# EAGLE schematic avr (EAGLE 5.07)
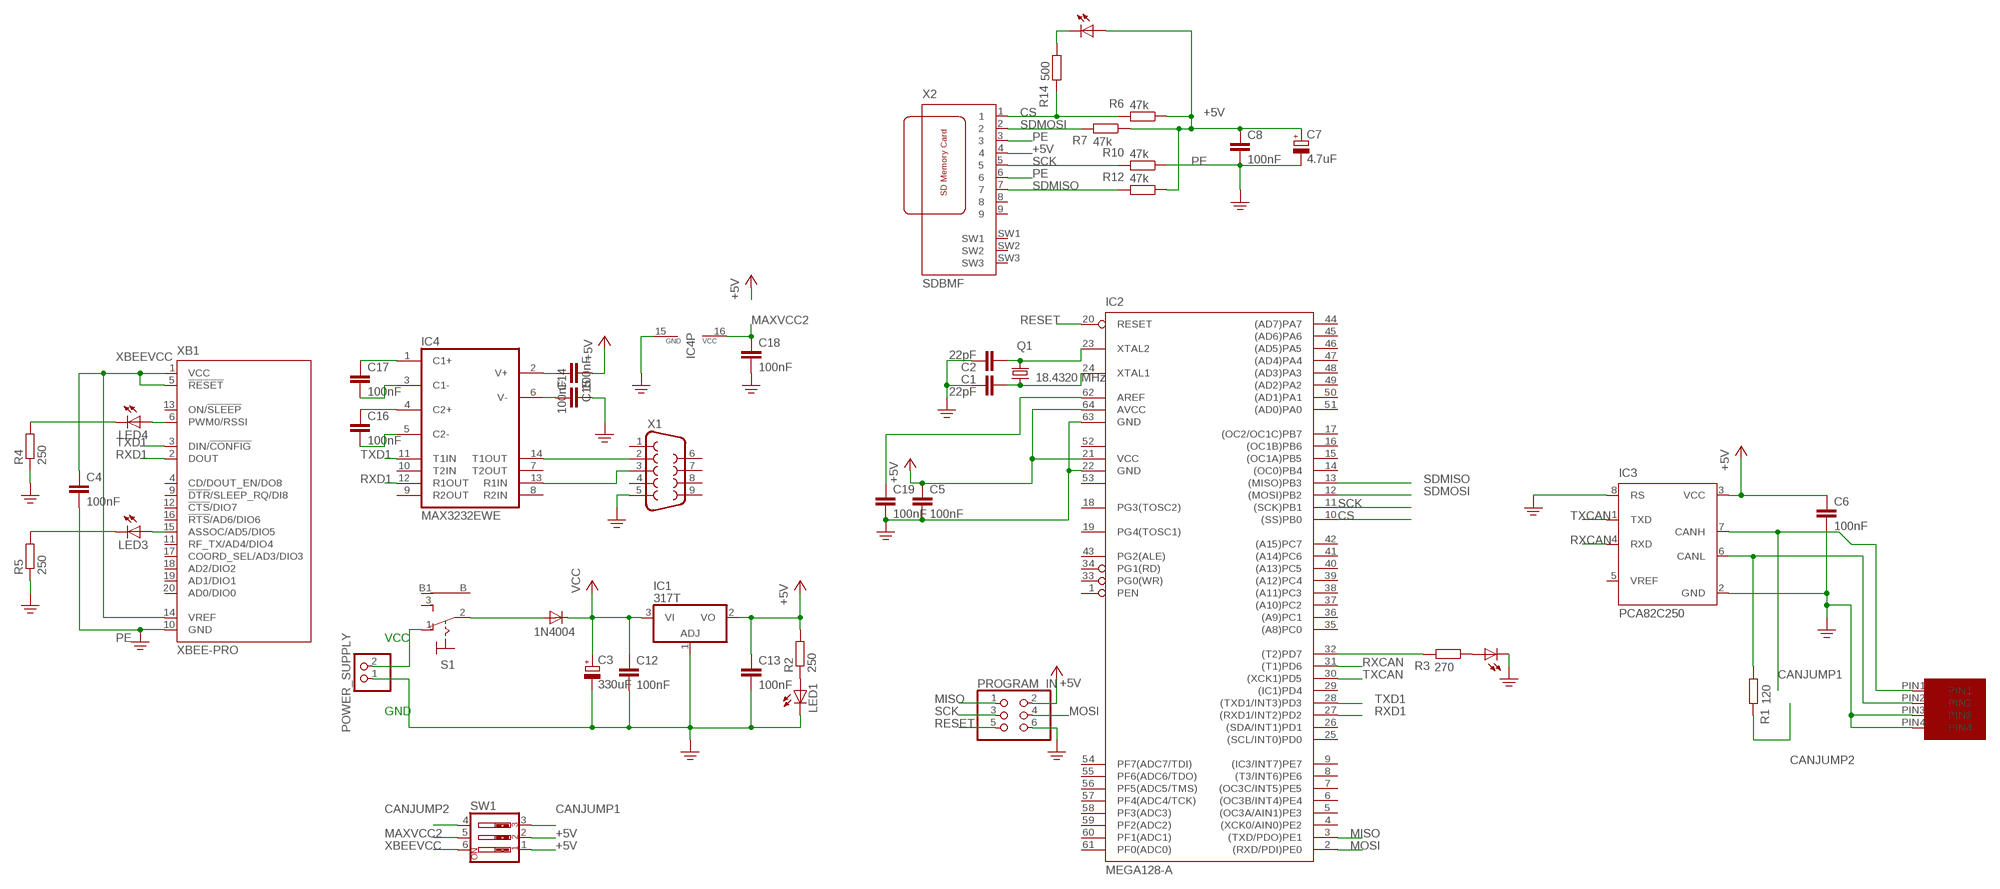
[diagram p0: schematic, sheet 1]

## Parts
C1  22pF  C5/2.5  [C5B2.5]
C2  22pF  C5/2.5  [C5B2.5]
C3  330uF  CPOL-EUE15-5AXIAL  [E15-5]
C4  100nF  C-EU050-024X044  [C050-024X044]
C5  100nF  C-EU050-024X044  [C050-024X044]
C6  100nF  C-EU050-024X044  [C050-024X044]
C7  4.7uF  CPOL-EUE15-5AXIAL  [E15-5]
C8  100nF  C-EU050-024X044  [C050-024X044]
C12  100nF  C-EU050-024X044  [C050-024X044]
C13  100nF  C-EU050-024X044  [C050-024X044]
C14  100nF  C-EU050-024X044  [C050-024X044]
C15  100nF  C-EU050-024X044  [C050-024X044]
C16  100nF  C-EU050-024X044  [C050-024X044]
C17  100nF  C-EU050-024X044  [C050-024X044]
C18  100nF  C-EU050-024X044  [C050-024X044]
C19  100nF  C-EU050-024X044  [C050-024X044]
D1  1N4004  [DO41-10]
IC1  317T  [TO220H]
IC2  MEGA128-A  [TQFP64]
IC3  PCA82C250  [DIL08]
IC4  MAX3232EWE  [SO16L]
LED1  LED5MM  [LED5MM]
LED2  LED5MM  [LED5MM]
LED3  LED5MM  [LED5MM]
LED4  LED5MM  [LED5MM]
LED5  LED5MM  [LED5MM]
POWER_SUPPLY  PINHD-1X2  [1X02]
PROGRAM_IN  PINHD-2X3  [2X03]
Q1  18.4320 MHz  CRYSTALHC49U70  [HC49U70]
R1  120  R-EU_0207/10  [0207/10]
R2  250  R-EU_0207/10  [0207/10]
R3  270  R-EU_0207/10  [0207/10]
R4  250  R-EU_0207/10  [0207/10]
R5  250  R-EU_0207/10  [0207/10]
R6  47k  R-EU_0207/10  [0207/10]
R7  47k  R-EU_0207/10  [0207/10]
R10  47k  R-EU_0207/10  [0207/10]
R12  47k  R-EU_0207/10  [0207/10]
R14  500  R-EU_0207/10  [0207/10]
S1  LPV-1  [LPV-1]
SW1  SW_DIP-3  [EDG-03]
U$1  MICROFIT4  [MICROFIT4SOCK]
X1  F09HP  [F09HP]
X2  SDBMF  [SDBMF-009XXBXX2]
XB1  XBEE-PRO  [XBEE-PRO]

## Nets
+5V: C5.1 C6.1 C7.+ C8.1 C13.1 C15.1 IC1.2(VO) IC2.21(VCC) IC2.64(AVCC) IC3.3(VCC) LED5.A PROGRAM_IN.2 R2.2 R6.1 R7.1 R12.1 SW1.1 SW1.2 X2.4
CANJUMP1: IC3.7(CANH) SW1.3 U$1.PIN1
CANJUMP2: R1.2 SW1.4
CS: IC2.10((SS)PB0) R6.2 R14.2 X2.1
MAXVCC2: C18.1 IC4.16(VCC) SW1.5
MISO: IC2.3((TXD/PDO)PE1) PROGRAM_IN.1
MOSI: IC2.2((RXD/PDI)PE0) PROGRAM_IN.4
N$1: C1.2 IC2.24(XTAL1) Q1.1
N$2: C2.2 IC2.23(XTAL2) Q1.2
N$4: D1.A S1.2(P)
N$5: POWER_SUPPLY.2 S1.1(O)
N$6: LED1.A R2.1
N$8: LED2.A R3.1
N$10: C19.1 IC2.62(AREF)
N$21: IC4.13(R1IN) X1.3
N$33: IC4.14(T1OUT) X1.2
N$35: C17.1 IC4.1(C1+)
N$36: C17.2 IC4.3(C1-)
N$37: C16.1 IC4.4(C2+)
N$38: C16.2 IC4.5(C2-)
N$39: C14.1 IC4.6(V-)
N$41: C15.2 IC4.2(V+)
N$43: IC2.32((T2)PD7) R3.2
N$50: LED4.A XB1.6(PWM0/RSSI)
N$51: IC3.6(CANL) R1.1 U$1.PIN2
N$52: LED3.A XB1.15(ASSOC/AD5/DIO5)
N$57: LED4.K(C) R4.2
N$58: LED3.K(C) R5.2
N$59: LED5.K(C) R14.1
PE: C1.1 C2.1 C3.- C4.2 C5.2 C6.2 C7.- C8.2 C12.2 C13.2 C14.2 C18.2 C19.2 IC1.1(ADJ) IC2.22(GND) IC2.63(GND) IC3.2(GND) IC3.8(RS) IC4.15(GND) LED1.K(C) LED2.K(C) POWER_SUPPLY.1 PROGRAM_IN.6 R4.1 R5.1 R10.1 U$1.PIN3 U$1.PIN4 X1.5 X2.3 X2.6 XB1.10(GND)
RESET: IC2.20(RESET) PROGRAM_IN.5
RXCAN: IC2.31((T1)PD6) IC3.4(RXD)
RXD1: IC2.27((RXD1/INT2)PD2) IC4.12(R1OUT) XB1.2(DOUT)
SCK: IC2.11((SCK)PB1) PROGRAM_IN.3 R10.2 X2.5
SDMISO: IC2.13((MISO)PB3) R12.2 X2.7
SDMOSI: IC2.12((MOSI)PB2) R7.2 X2.2
TXCAN: IC2.30((XCK1)PD5) IC3.1(TXD)
TXD1: IC2.28((TXD1/INT3)PD3) IC4.11(T1IN) XB1.3(DIN/!CONFIG)
VCC: C3.+ C12.1 D1.C IC1.3(VI)
XBEEVCC: C4.1 SW1.6 XB1.1(VCC) XB1.5(!RESET) XB1.14(VREF)
Unconnected: IC2.1(PEN) IC2.4((XCK0/AIN0)PE2) IC2.5((OC3A/AIN1)PE3) IC2.6((OC3B/INT4)PE4) IC2.7((OC3C/INT5)PE5) IC2.8((T3/INT6)PE6) IC2.9((IC3/INT7)PE7) IC2.14((OC0)PB4) IC2.15((OC1A)PB5) IC2.16((OC1B)PB6) IC2.17((OC2/OC1C)PB7) IC2.18(PG3(TOSC2)) IC2.19(PG4(TOSC1)) IC2.25((SCL/INT0)PD0) IC2.26((SDA/INT1)PD1) IC2.29((IC1)PD4) IC2.33(PG0(WR)) IC2.34(PG1(RD)) IC2.35((A8)PC0) IC2.36((A9)PC1) IC2.37((A10)PC2) IC2.38((A11)PC3) IC2.39((A12)PC4) IC2.40((A13)PC5) IC2.41((A14)PC6) IC2.42((A15)PC7) IC2.43(PG2(ALE)) IC2.44((AD7)PA7) IC2.45((AD6)PA6) IC2.46((AD5)PA5) IC2.47((AD4)PA4) IC2.48((AD3)PA3) IC2.49((AD2)PA2) IC2.50((AD1)PA1) IC2.51((AD0)PA0) IC2.54(PF7(ADC7/TDI)) IC2.55(PF6(ADC6/TDO)) IC2.56(PF5(ADC5/TMS)) IC2.57(PF4(ADC4/TCK)) IC2.58(PF3(ADC3)) IC2.59(PF2(ADC2)) IC2.60(PF1(ADC1)) IC2.61(PF0(ADC0)) IC3.5(VREF) IC4.7(T2OUT) IC4.8(R2IN) IC4.9(R2OUT) IC4.10(T2IN) S1.3(S) S1.B S1.B1 X1.1 X1.4 X1.6 X1.7 X1.8 X1.9 X2.8 X2.9 X2.SW1 X2.SW2 X2.SW3 XB1.4(CD/DOUT_EN/DO8) XB1.9(!DTR!/SLEEP_RQ/DI8) XB1.11(RF_TX/AD4/DIO4) XB1.12(!CTS!/DIO7) XB1.13(ON/!SLEEP) XB1.16(!RTS!/AD6/DIO6) XB1.17(COORD_SEL/AD3/DIO3) XB1.18(AD2/DIO2) XB1.19(AD1/DIO1) XB1.20(AD0/DIO0)

## Notes on the sheet
- VCC
- GND

## Power pins joined to a net without a drawn wire
GND1: IC2.53(GND1)
VCC1: IC2.52(VCC1)

## Library data of the parts
C1 C2 = capacitor-wima:C: CAPACITOR naming: grid - package width
C3 C7 = rcl:CPOL-EU: POLARIZED CAPACITOR, European symbol
C4-C6 C8 C12-C19 = rcl:C-EU: CAPACITOR, European symbol
D1 = diode:1N4004: DIODE general purpose rectifier, 1 A
IC1 = linear:*317: Positive VOLTAGE REGULATOR
IC2 = atmel:MEGA128: MICROCONTROLLER 128 Kbytes FLASH 4 Kbytes SRAM 4 Kbytes EEPROM DUAL USART 8-channel 10 bit ADC Source: avr.lbr
IC3 = micro-philips:PCA82C250: CAN CONTROLLER INTERFACE
IC4 = maxim:MAX3232*: True RS-232 Transceivers 3.0V to 5.5V, Low-Power up to 1Mbps, Using Four 0.1µF External Capacitors Source: http://pdfserv.maxim-ic.com/en/ds/MAX3222-MAX3241.pdf
LED1-LED5 = led:LED: LED OSRAM: - CHIPLED LG R971, LG N971, LY N971, LG Q971, LY Q971, LO R971, LY R971 LH N974, LH R974 LS Q976, LO Q976, LY Q976 LO Q996 - Hyper CHIPLED LW Q18S LB Q993, LB Q99A, LB R99A - SideLED LS A670, LO A670, LY A670, LG A670, LP A670 LB A673, LV A673, LT A673, LW A673 LH A674 LY A675 LS A676, LA A676, LO A676, LY A676, LW A676 LS A679, LY A679, LG A679 - Hyper Micro SIDELED® LS Y876, LA Y876, LO Y876, LY Y876 LT Y87S - SmartLED LW L88C, LW L88S LB L89C, LB L89S, LG L890 LS L89K, LO L89K, LY L89K LS L896, LA L896, LO L896, LY L896 - TOPLED LS T670, LO T670, LY T670, LG T670, LP T670 LSG T670, LSP T670, LSY T670, LOP T670, LYG T670 LG T671, LOG T671, LSG T671 LB T673, LV T673, LT T673, LW T673 LH T674 LS T676, LA T676, LO T676, LY T676, LB T676, LH T676, LSB T676, LW T676 LB T67C, LV T67C, LT T67C, LS T67K, LO T67K, LY T67K, LW E67C LS E67B, LA E67B, LO E67B, LY E67B, LB E67C, LV E67C, LT E67C LW T67C LS T679, LY T679, LG T679 LS T770, LO T770, LY T770, LG T770, LP T770 LB T773, LV T773, LT T773, LW T773 LH T774 LS E675, LA E675, LY E675, LS T675 LS T776, LA T776, LO T776, LY T776, LB T776 LHGB T686 LT T68C, LB T68C - Hyper Mini TOPLED® LB M676 - Mini TOPLED Santana® LG M470 LS M47K, LO M47K, LY M47K Source: http://www.osram.convergy.de LUXEON: - LUMILED® LXK2-PW12-R00, LXK2-PW12-S00, LXK2-PW14-U00, LXK2-PW14-V00 LXK2-PM12-R00, LXK2-PM12-S00, LXK2-PM14-U00 LXK2-PE12-Q00, LXK2-PE12-R00, LXK2-PE12-S00, LXK2-PE14-T00, LXK2-PE14-U00 LXK2-PB12-K00, LXK2-PB12-L00, LXK2-PB12-M00, LXK2-PB14-N00, LXK2-PB14-P00, LXK2-PB14-Q00 LXK2-PR12-L00, LXK2-PR12-M00, LXK2-PR14-Q00, LXK2-PR14-R00 LXK2-PD12-Q00, LXK2-PD12-R00, LXK2-PD12-S00 LXK2-PH12-R00, LXK2-PH12-S00 LXK2-PL12-P00, LXK2-PL12-Q00, LXK2-PL12-R00 Source: www.luxeon.com KINGBRIGHT: KA-3528ASYC Source: www.kingbright.com
POWER_SUPPLY = pinhead:PINHD-1X2: PIN HEADER
PROGRAM_IN = pinhead:PINHD-2X3: PIN HEADER
Q1 = crystal:CRYSTAL: CRYSTAL
R1-R7 R10 R12 R14 = resistor:R-EU_: RESISTOR, European symbol
S1 = switch:LPV-1: TOGGLE SWITCH
SW1 = special:SW_DIP-3: DIP SWITCH
U$1 = UNICORN:MICROFIT4
X1 = con-subd:F09: SUB-D
X2 = farnell:SDBMF: SD MEMORY CARD PUSH-PUSH WITH CONNECTOR TYPE B (BIG SWUÌTCH #3) KINGFONT PRECISION INDUSTIAL CO., LTD Source: http://www.farnell.com/datasheets/74273.pdf Best.-Nr.: 9186174 Hersteller: MULTICOMP Herstellerbez.: SDBMF-00915B0T2
XB1 = maxstream:XBEE: XBee (TM) /XBee-PRO(TM) OEM RF Modules Source: MaxStream, Inc. xbee_productmanual.pdf